# Altium project CRZ Command and Control.PrjPcb
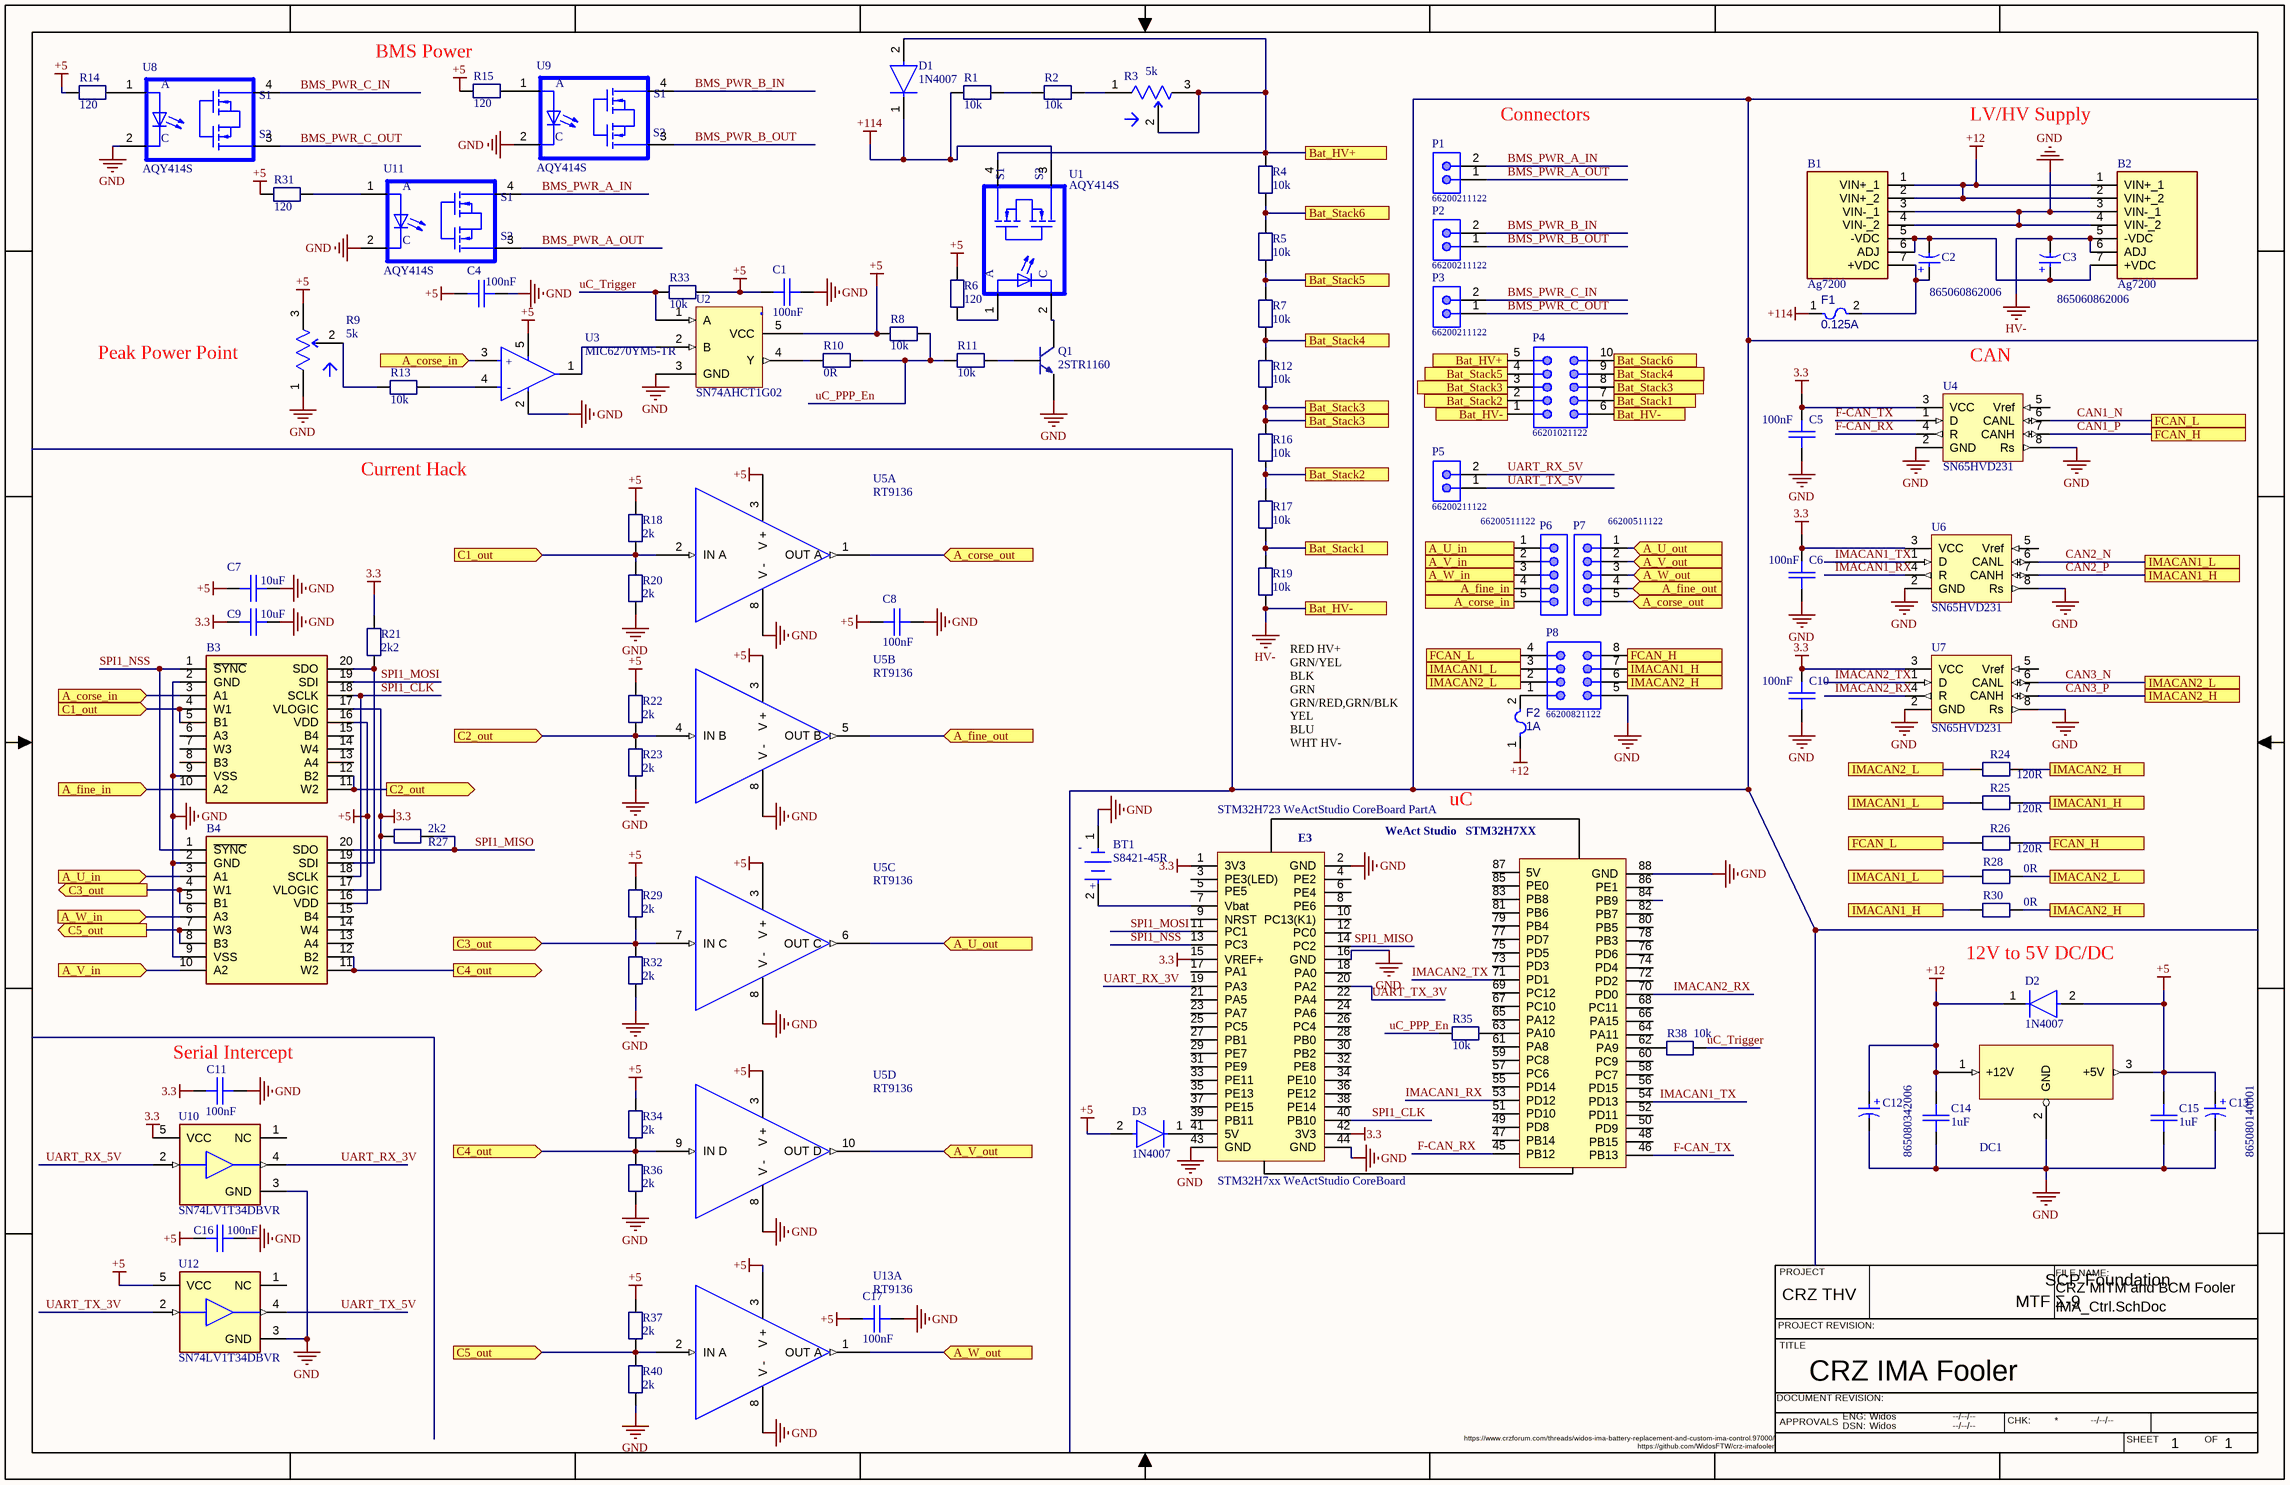
[diagram p0: IMA_Ctrl.SchDoc]
CAGE_CODE: ?????; CONTRACT_NUMBER: <CONTRACT NO>; DOC_NO_ASSY_DWG: <ASSY DWG NO>; DOC_NO_BOM: <BOM DOC NO>; DOC_NO_FAB_DWG: <FAB DWG NO>; DOC_NO_SCH_DWG: <SCH DWG NO>; PCB_2_DEC_TOL: +/-.01; PCB_3_DEC_TOL: +/-.010; PCB_ANG_TOL: +/-1/2; PCB_ASSEMBLY_NO: <PCB ASSY NO>; PCB_CHECKER: - -----; PCB_CHECKER_APP_DATE: --/--/----; PCB_DESIGNER: - -----; PCB_DESIGNER_APP_DATE: --/--/----; PCB_DWG_NO: <PCB DWG NO>; PCB_ENGINEER: - -----; PCB_ENGINEER_APP_DATE: --/--/----; PCB_PART_NUMBER: <PCB PN>; PCB_REV: A; SCH_REV: A
1 sheet, 90 parts. Net scope: flat (ports and power ports of the same name join across sheets).
Board file: CRZ_IMAFool.PcbDoc

## Sheet IMA_Ctrl.SchDoc: CRZ IMA Fooler
size 431 x 279 mm; Date: 01.11.2023; Author: Widos; CompanyName: CR-Z Forum; DrawnBy: Widos; Engineer: Widos; Address1: https://www.crzforum.com/threads/widos-ima-battery-replacement-and-custom-ima-control.97000/; Address2: https://github.com/WidosFTW/crz-imafooler; DocumentNumber: 1; Revision: 3; SheetNumber: 1; SheetTotal: 1; Project: CRZ THV; ENG_APP_DATE: --/--/--; DSN_APP_DATE: --/--/--; CHK_APP_DATE: --/--/--; DocumentDescription: CRZ MITM and BCM Fooler; Time: 22:00; ImagePath: C:\Users\widos\Downloads\crz.png

### Parts
B1  Ag7200  [Ag7200]
B2  Ag7200  [Ag7200]
B3  AD5144BRUZ10  [SOP65P640X120-20N]  (value not drawn)
B4  AD5144BRUZ10  [SOP65P640X120-20N]  (value not drawn)
BT1  S8421-45R  [FP-S8421-45R-MFG]
C1  Capacity: 100nF  [0805_Cap]  (hidden comment: 0805_Cap)
C2  865060862006  [WCAP-ASLL_D12.5H14]
C3  865060862006  [WCAP-ASLL_D12.5H14]
C4  Capacity: 100nF  [0805_Cap]  (hidden comment: 0805_Cap)
C5  Capacity: 100nF  [0805_Cap]  (hidden comment: 0805_Cap)
C6  Capacity: 100nF  [0805_Cap]  (hidden comment: 0805_Cap)
C7  Capacity: 10uF  [0805_Cap]  (hidden comment: 0805_Cap)
C8  Capacity: 100nF  [0805_Cap]  (hidden comment: 0805_Cap)
C9  Capacity: 10uF  [0805_Cap]  (hidden comment: 0805_Cap)
C10  Capacity: 100nF  [0805_Cap]  (hidden comment: 0805_Cap)
C11  Capacity: 100nF  [0805_Cap]  (hidden comment: 0805_Cap)
C12  865080342006  [WCAP-ASLI_D5H5.5]
C13  865080140001  [WCAP-ASLI_D4H5.5]
C14  Capacity: 1uF  [0805_Cap]  (hidden comment: 0805_Cap)
C15  Capacity: 1uF  [0805_Cap]  (hidden comment: 0805_Cap)
C16  Capacity: 100nF  [0805_Cap]  (hidden comment: 0805_Cap)
C17  Capacity: 100nF  [0805_Cap]  (hidden comment: 0805_Cap)
D1  1N4007  [FP-1N4007-MFG]
D2  1N4007  [FP-1N4007-MFG]
D3  1N4007  [FP-1N4007-MFG]
DC1  RECOM-785-5.0  [RECOM_DCDC]  (value not drawn)
F1  0.125A  [LFUS-466_V]
F2  1A  [LFUS-466_V]
P1  66200211122  [66200211122]
P2  66200211122  [66200211122]
P3  66200211122  [66200211122]
P4  66201021122  [66201021122]
P5  66200211122  [66200211122]
P6  66200511122  [66200511122]
P7  66200511122  [66200511122]
P8  66200821122  [66200821122]
Q1  2STR1160  [SOT85P255X140-3N]
R1  Resistance: 10k  [0805_Res]  (hidden comment: 0805_Resistor)
R2  Resistance: 10k  [0805_Res]  (hidden comment: 0805_Resistor)
R3  5k  [FP-PV36W-MFG]
R4  Resistance: 10k  [0805_Res]  (hidden comment: 0805_Resistor)
R5  Resistance: 10k  [0805_Res]  (hidden comment: 0805_Resistor)
R6  Resistance: 120  [0805_Res]  (hidden comment: 0805_Resistor)
R7  Resistance: 10k  [0805_Res]  (hidden comment: 0805_Resistor)
R8  Resistance: 10k  [0805_Res]  (hidden comment: 0805_Resistor)
R9  5k  [FP-PV36W-MFG]
R10  Resistance: 0R  [0805_Res]  (hidden comment: 0805_Resistor)
R11  Resistance: 10k  [0805_Res]  (hidden comment: 0805_Resistor)
R12  Resistance: 10k  [0805_Res]  (hidden comment: 0805_Resistor)
R13  Resistance: 10k  [0805_Res]  (hidden comment: 0805_Resistor)
R14  Resistance: 120  [0805_Res]  (hidden comment: 0805_Resistor)
R15  Resistance: 120  [0805_Res]  (hidden comment: 0805_Resistor)
R16  Resistance: 10k  [0805_Res]  (hidden comment: 0805_Resistor)
R17  Resistance: 10k  [0805_Res]  (hidden comment: 0805_Resistor)
R18  Resistance: 2k  [0805_Res]  (hidden comment: 0805_Resistor)
R19  Resistance: 10k  [0805_Res]  (hidden comment: 0805_Resistor)
R20  Resistance: 2k  [0805_Res]  (hidden comment: 0805_Resistor)
R21  Resistance: 2k2  [0805_Res]  (hidden comment: 0805_Resistor)
R22  Resistance: 2k  [0805_Res]  (hidden comment: 0805_Resistor)
R23  Resistance: 2k  [0805_Res]  (hidden comment: 0805_Resistor)
R24  Resistance: 120R  [0805_Res]  (hidden comment: 0805_Resistor)
R25  Resistance: 120R  [0805_Res]  (hidden comment: 0805_Resistor)
R26  Resistance: 120R  [0805_Res]  (hidden comment: 0805_Resistor)
R27  Resistance: 2k2  [0805_Res]  (hidden comment: 0805_Resistor)
R28  Resistance: 0R  [0805_Res]  (hidden comment: 0805_Resistor)
R29  Resistance: 2k  [0805_Res]  (hidden comment: 0805_Resistor)
R30  Resistance: 0R  [0805_Res]  (hidden comment: 0805_Resistor)
R31  Resistance: 120  [0805_Res]  (hidden comment: 0805_Resistor)
R32  Resistance: 2k  [0805_Res]  (hidden comment: 0805_Resistor)
R33  Resistance: 10k  [0805_Res]  (hidden comment: 0805_Resistor)
R34  Resistance: 2k  [0805_Res]  (hidden comment: 0805_Resistor)
R35  Resistance: 10k  [0805_Res]  (hidden comment: 0805_Resistor)
R36  Resistance: 2k  [0805_Res]  (hidden comment: 0805_Resistor)
R37  Resistance: 2k  [0805_Res]  (hidden comment: 0805_Resistor)
R38  Resistance: 10k  [0805_Res]  (hidden comment: 0805_Resistor)
R40  Resistance: 2k  [0805_Res]  (hidden comment: 0805_Resistor)
STM32H723_WeActStudio_CoreBoard_Part  STM32H7xx WeActStudio CoreBoard  [STM32H7xx Core Board]  (part A of 2)
U1  AQY414S  [SOIC254P695X242-4N]
U2  SN74AHCT1G02  [SOT23-5_LT1716]
U3  MIC6270YM5-TR  [FP-SOT23-5LD-PL-1-MFG]
U4  SN65HVD231  [D008_N]
U5  RT9136  [AD8244]  (parts A,B,C,D of 4)
U6  SN65HVD231  [D008_N]
U7  SN65HVD231  [D008_N]
U8  AQY414S  [SOIC254P695X242-4N]
U9  AQY414S  [SOIC254P695X242-4N]
U10  SN74LV1T34DBVR  [FP-DBV0005A-IPC_B]
U11  AQY414S  [SOIC254P695X242-4N]
U12  SN74LV1T34DBVR  [FP-DBV0005A-IPC_B]
U13  RT9136  [AD8244]  (part A of 4)

### Ports
A_corse_in (in), A_corse_in (out), A_corse_out (in), A_fine_in (in), A_fine_in (out), A_fine_out (in), A_U_in (in), A_U_in (out), A_U_out (in), A_V_in (in), A_V_in (out), A_V_out (in), A_W_in (in), A_W_in (out), A_W_out (in), Bat_HV+, Bat_HV-, Bat_Stack1, Bat_Stack2, Bat_Stack3, Bat_Stack4, Bat_Stack5, Bat_Stack6, C1_out (in), C2_out (in), C2_out (out), C3_out (in), C3_out (out), C4_out (in), C4_out (out), C5_out (in), C5_out (out), FCAN_H, FCAN_L, IMACAN1_H, IMACAN1_L, IMACAN2_H, IMACAN2_L

### Nets
3.3: B3.17(VLOGIC) B4.17(VLOGIC) C5.2 C6.2 C9.1 C10.2 C11.1 R21.1 R27.2 STM32H723_WeActStudio_CoreBoard_Part.1(3V3) STM32H723_WeActStudio_CoreBoard_Part.15(VREF+) STM32H723_WeActStudio_CoreBoard_Part.42(3V3) U4.3(VCC) U6.3(VCC) U7.3(VCC) U10.5(VCC)
+5: B3.16(VDD) B4.16(VDD) C1.1 C4.1 C7.1 C8.1 C13.1(P) C15.2 C16.1 C17.1 D2.2(A) D3.2(A) DC1.3(+5V) R6.2 R8.1 R9.3 R14.1 R15.1 R18.1 R22.1 R29.1 R31.1 R33.2 R34.1 R37.1 U2.5(VCC) U3.5(V+) U5.3(V_+) U12.5(VCC) U13.3(V_+)
+12: B1.1(VIN+_1) B1.2(VIN+_2) B2.1(VIN+_1) B2.2(VIN+_2) C12.1(P) C14.2 D2.1(C) DC1.1(+12V) F2.1
+114: D1.1(C) F1.1 R1.1 U1.3(S2)
GND: B1.3(VIN-_1) B1.4(VIN-_2) B2.3(VIN-_1) B2.4(VIN-_2) B3.2(GND) B3.9(VSS) B4.2(GND) B4.9(VSS) BT1.1(C) C1.2 C4.2 C5.1 C6.1 C7.2 C8.2 C9.2 C10.1 C11.2 C12.2(N) C13.2(N) C14.1 C15.1 C16.2 C17.2 DC1.2(GND) P8.5 Q1.2(E) R9.1 R20.2 R23.2 R32.2 R36.2 R40.2 STM32H723_WeActStudio_CoreBoard_Part.2(GND) STM32H723_WeActStudio_CoreBoard_Part.16(GND) STM32H723_WeActStudio_CoreBoard_Part.43(GND) STM32H723_WeActStudio_CoreBoard_Part.44(GND) STM32H723_WeActStudio_CoreBoard_Part.88(GND) U2.3(GND) U3.2(V-) U4.2(GND) U4.8(Rs) U5.8(V_-) U6.2(GND) U6.8(Rs) U7.2(GND) U7.8(Rs) U8.2(C) U9.2(C) U10.3(GND) U11.2(C) U12.3(GND) U13.8(V_-)
HV-: B2.5(-VDC) B2.6(ADJ) C3.2(N) P4.1 P4.6 R19.2 ; port Bat_HV-
A_corse_in: B3.3(A1) P6.5 U3.3(IN+) ; port A_corse_in
A_corse_out: P7.5 U5.1(OUT_A) ; port A_corse_out
A_fine_in: B3.10(A2) P6.4 ; port A_fine_in
A_fine_out: P7.4 U5.5(OUT_B) ; port A_fine_out
A_U_in: B4.3(A1) P6.1 ; port A_U_in
A_U_out: P7.1 U5.6(OUT_C) ; port A_U_out
A_V_in: B4.10(A2) P6.2 ; port A_V_in
A_V_out: P7.2 U5.10(OUT_D) ; port A_V_out
A_W_in: B4.6(A3) P6.3 ; port A_W_in
A_W_out: P7.3 U13.1(OUT_A) ; port A_W_out
Bat_HV+: D1.2(A) P4.5 R3.2(Wiper) R3.3 R4.1 U1.4(S1) ; port Bat_HV+
Bat_Stack1: P4.7 R17.2 R19.1 ; port Bat_Stack1
Bat_Stack2: P4.2 R16.2 R17.1 ; port Bat_Stack2
Bat_Stack3: P4.3 P4.8 R12.2 R16.1 ; port Bat_Stack3
Bat_Stack4: P4.9 R7.2 R12.1 ; port Bat_Stack4
Bat_Stack5: P4.4 R5.2 R7.1 ; port Bat_Stack5
Bat_Stack6: P4.10 R4.2 R5.1 ; port Bat_Stack6
BMS_PWR_A_IN: P1.2 U11.4(S1)
BMS_PWR_A_OUT: P1.1 U11.3(S2)
BMS_PWR_B_IN: P2.2 U9.4(S1)
BMS_PWR_B_OUT: P2.1 U9.3(S2)
BMS_PWR_C_IN: P3.2 U8.4(S1)
BMS_PWR_C_OUT: P3.1 U8.3(S2)
C1_out: B3.4(W1) B3.5(B1) R18.2 R20.1 U5.2(IN_A) ; port C1_out
C2_out: B3.11(W2) B3.12(B2) R22.2 R23.1 U5.4(IN_B) ; port C2_out
C3_out: B4.4(W1) B4.5(B1) R29.2 R32.1 U5.7(IN_C) ; port C3_out
C4_out: B4.11(W2) B4.12(B2) R34.2 R36.1 U5.9(IN_D) ; port C4_out
C5_out: B4.7(W3) B4.8(B3) R37.2 R40.1 U13.2(IN_A) ; port C5_out
CAN1_N: P8.4 R26.1 U4.6(CANL) ; port FCAN_L
CAN1_P: P8.8 R26.2 U4.7(CANH) ; port FCAN_H
CAN2_N: P8.3 R25.1 R28.1 U6.6(CANL) ; port IMACAN1_L
CAN2_P: P8.7 R25.2 R30.1 U6.7(CANH) ; port IMACAN1_H
CAN3_N: P8.2 R24.1 R28.2 U7.6(CANL) ; port IMACAN2_L
CAN3_P: P8.6 R24.2 R30.2 U7.7(CANH) ; port IMACAN2_H
F-CAN_RX: STM32H723_WeActStudio_CoreBoard_Part.45(PB12) U4.4(R)
F-CAN_TX: STM32H723_WeActStudio_CoreBoard_Part.46(PB13) U4.1(D)
IMACAN1_RX: STM32H723_WeActStudio_CoreBoard_Part.53(PD12) U6.4(R)
IMACAN1_TX: STM32H723_WeActStudio_CoreBoard_Part.54(PD13) U6.1(D)
IMACAN2_RX: STM32H723_WeActStudio_CoreBoard_Part.70(PD0) U7.4(R)
IMACAN2_TX: STM32H723_WeActStudio_CoreBoard_Part.71(PD1) U7.1(D)
SPI1_CLK: B3.18(SCLK) B4.18(SCLK) STM32H723_WeActStudio_CoreBoard_Part.40(PB10)
SPI1_MISO: B4.20(SDO) R27.1 STM32H723_WeActStudio_CoreBoard_Part.14(PC2)
SPI1_MOSI: B3.19(SDI) STM32H723_WeActStudio_CoreBoard_Part.11(PC1)
SPI1_NSS: B3.1(~{SYNC}) B4.1(~{SYNC}) STM32H723_WeActStudio_CoreBoard_Part.13(PC3)
UART_RX_3V: STM32H723_WeActStudio_CoreBoard_Part.19(PA3) U10.4(Y)
UART_RX_5V: P5.2 U10.2(A)
UART_TX_3V: STM32H723_WeActStudio_CoreBoard_Part.20(PA2) U12.2(A)
UART_TX_5V: P5.1 U12.4(Y)
uC_PPP_En: R8.2 R10.2 R11.1 R35.2
uC_Trigger: R33.1 R38.2 U2.1(A)
NetB1_5: B1.5(-VDC) B1.6(ADJ) B2.7(+VDC) C2.2(N) C3.1(P)
NetB1_7: B1.7(+VDC) C2.1(P) F1.2
NetB3_20: B3.20(SDO) B4.19(SDI) R21.2
NetBT1_2: BT1.2(A) STM32H723_WeActStudio_CoreBoard_Part.7(Vbat)
NetD3_1: D3.1(C) STM32H723_WeActStudio_CoreBoard_Part.41(5V)
NetF2_2: F2.2 P8.1
NetQ1_1: Q1.1(B) R11.2
NetQ1_3: Q1.3(C) U1.2(C)
NetR1_2: R1.2 R2.1
NetR2_2: R2.2 R3.1
NetR6_1: R6.1 U1.1(A)
NetR9_2: R9.2(Wiper) R13.1
NetR10_1: R10.1 U2.4(Y)
NetR13_2: R13.2 U3.4(IN-)
NetR14_2: R14.2 U8.1(A)
NetR15_2: R15.2 U9.1(A)
NetR31_2: R31.2 U11.1(A)
NetR35_1: R35.1 STM32H723_WeActStudio_CoreBoard_Part.63(PA10)
NetR38_1: R38.1 STM32H723_WeActStudio_CoreBoard_Part.62(PA9)
NetU2_2: U2.2(B) U3.1(OUT)

Not connected (* = marked no-connect by the designer): B3 6(A3) 7(W3) 8(B3) 13(A4) 14(W4) 15(B4); B4 13(A4) 14(W4) 15(B4); STM32H723_WeActStudio_CoreBoard_Part 3(PE3(LED)) 4(PE2) 5(PE5) 6(PE4) 8(PE6) 9(NRST) 10(PC13(K1)) 12(PC0) 17(PA1) 18(PA0) 21(PA5) 22(PA4) 23(PA7) 24(PA6) 25(PC5) 26(PC4) 27(PB1) 28(PB0) 29(PE7) 30(PB2) 31(PE9) 32(PE8) 33(PE11) 34(PE10) 35(PE13) 36(PE12) 37(PE15) 38(PE14) 39(PB11) 47(PB14) 48(PB15) 49(PD8) 50(PD9) 51(PD10) 52(PD11) 55(PD14) 56(PD15) 57(PC6) 58(PC7) 59(PC8) 60(PC9) 61(PA8) 64(PA11) 65(PA12) 66(PA15) 67(PC10) 68(PC11) 69(PC12) 72(PD2) 73(PD3) 74(PD4) 75(PD5) 76(PD6) 77(PD7) 78(PB3) 79(PB4) 80(PB5) 81(PB6) 82(PB7) 83(PB8) 84(PB9) 85(PE0) 86(PE1) 87(5V); U4 5(Vref); U6 5(Vref); U7 5(Vref); U10 1(NC); U12 1(NC)

### Notes on the sheet
- (near R15) BMS Power
- Connectors
- LV/HV Supply
- (near R9) Peak Power Point
- (near U4) CAN
- Current Hack
- (near R19) RED HV+
  GRN/YEL
  BLK
  GRN
  GRN/RED,GRN/BLK
  YEL
  BLU
  WHT HV-
- uC
- 12V to 5V DC/DC
- (near C11) Serial Intercept
- PROJECT
- MTF Σ-9
- SCP Foundation
- FILE NAME:
- PROJECT REVISION:
- TITLE
- DOCUMENT REVISION:
- APPROVALS
- ENG:
- DSN:
- CHK:
- SHEET
- OF
- (in symbol CMP-038-000000-1, part A) WeAct Studio; STM32H7XX; E3
- (in symbol CMP-2000-07028-3) -; +
- (in symbol CMP-03913-53914532-1) +
- (in symbol CMP-03913-53914570-1) +
- (in symbol CMP-03913-130590180-1) +
- (in symbol CMP-06303-000001-1) +; -

### Library data of the parts
B1 B2 = CMP-029-000000-1: Isolated DC/DC Converters 20W boost converter. 36V-57Vout, 5V-15V in, SIL; Manufacturer_Name: Silvertel; Geometry.Height: 14mm; Design Item ID: Ag7200; Mouser Part Number: 480-AG7200; Datasheet Link: https://silvertel.com/images/datasheets/Ag7200-datasheet-20W-Isolated-57V-DC-DC-Boost-Converter-Module.pdf; Mouser Price/Stock: https://www.mouser.co.uk/ProductDetail/Silvertel/Ag7200?qs=OlC7AqGiEDkYk2DJmVBe2Q%3D%3D; Source: Ag7200.SchLib; Arrow Price/Stock: *; Manufacturer_Part_Number: Ag7200; Arrow Part Number: *
B3 B4 = CMP-036-000000-1: AD5144BRUZ10, Digital Potentiometer 10k 256-Position Linear 4-channel Serial-SPI 20-Pin TSSOP; Manufacturer_Name: Analog Devices; Geometry.Height: 1.2mm; Arrow Part Number: AD5144BRUZ10; Mouser Part Number: 584-AD5144BRUZ10; Manufacturer_Part_Number: AD5144BRUZ10; Mouser Price/Stock: https://www.mouser.co.uk/ProductDetail/Analog-Devices/AD5144BRUZ10?qs=NmRFExCfTkGSml8dn6R%2FyA%3D%3D; Source: AD5144BRUZ10.SchLib; Arrow Price/Stock: https://www.arrow.com/en/products/ad5144bruz10/analog-devices?region=nac; Design Item ID: AD5144BRUZ10; Datasheet Link: http://uk.rs-online.com/web/p/products/7968827
BT1 = CMP-2000-07028-3: BATTERY HOLDER COIN 20MM SMD; Number of Cells: 1; Min Operating Temperature: -40°C; Packaging: Tape and Reel; Max Operating Temperature: 105°C; Number of Batteries: 1; Package Quantity: 500; Material: Polyphenylene; Case/Package: SMD/SMT; Mount: Surface Mount; REACH SVHC: No SVHC; Contact Plating: Bronze; Termination: SMD/SMT
C1 C4-C11 C14-C17 = CMP-004-000000-1: Component Type: Standard; Design Item ID: 0805_Cap; Source: KEMET.SchLib; Pin Count: 2
C2 C3 = CMP-03913-130590180-1: 865060862006 Cap, 68Uf, 20%, 100V, Alu Elec Smd Rohs Compliant: Yes; Ripple Current: 600mA; Leakage Current: 68µA; Impedance: 700mΩ; Insulation Resistance: 1.47059MΩ; Capacitance: 68µF; Width: 13.5mm; Diameter: 12.5mm; NexarPartId: 130590180; Length: 14mm; Voltage Rating: 100V
C12 = CMP-03913-53914570-1: 865080342006 WCAP-ASLI Aluminum Electrolytic Capacitors; ESR (Equivalent Series Resistance): 832.685mΩ; Impedance: 1.05Ω; Voltage Rating: 16V; Leakage Current: 7.52µA; Ripple Current: 195mA; Polarity: Polar; Insulation Resistance: 2.12766MΩ; Capacitance: 47µF; Tolerance: 20%; Life (Hours): 2000hours; Min Operating Temperature: -55°C; Case/Package: Radial; Height: 5.5mm; Height - Seated (Max): 5.5118mm; Diameter: 5mm; Width: 5.3mm; Voltage Rating (DC): 16V; Max Operating Temperature: 105°C; Ripple Current (AC): 195mA; Mount: Surface Mount; RoHS: Compliant; Packaging: Tape & Reel (TR); REACH SVHC: Unknown; NexarPartId: 53914570; Length: 5.5mm
C13 = CMP-03913-53914532-1: 865080140001 WCAP-ASLI Aluminum Electrolytic Capacitors; Life (Hours): 2000hours; ESR (Equivalent Series Resistance): 1.72087Ω; Capacitance: 22µF; Leakage Current: 3µA; Polarity: Polar; Tolerance: 20%; Voltage Rating: 6.3V; Insulation Resistance: 2.1MΩ; Ripple Current (AC): 75mA; Impedance: 2.2Ω; NexarPartId: 53914532; Packaging: Tape & Reel (TR); Min Operating Temperature: -55°C; Case/Package: Radial; Length: 5.5mm; Diameter: 4mm; RoHS: Compliant; Mount: Surface Mount; Height - Seated (Max): 5.5118mm; Voltage Rating (DC): 6.3V; Height: 5.5mm; Max Operating Temperature: 105°C; Width: 4.3mm; REACH SVHC: Unknown; Ripple Current: 75mA
D1-D3 = CMP-123542-000001-1: Rectifier diode 1000 V 1 A DO-41, ,; Manufacturer: Diotec; Max Surge Forward Current: 27A; Forward Current: 1A; Max Junction Temp: +175°C; Reverse Voltage: 1000V; Value: 15pF; Peak Reverse Current: 5uA; Category: Diode; Temperature Range Low: -50°C; Automotive: No; Temperature: -50°C to +175°C; Lead Free: Yes; ComponentLink2Description: Datasheet; Max Repetitive Reverse Voltage: 1000V; ComponentLink2URL: https://datasheet.octopart.com/1N4007-Diotec-datasheet-62346875.pdf; Manufacturer Part Number: 1N4007; Device Class L3: Rectifier Diodes; Height: 2.8mm; Octopart: https://octopart.com/1n4007-diotec-4040411; Package: 1N4007; Temperature Range High: +175°C; Device Class L1: Discrete Semiconductors; Device Class L2: Diodes; RoHS: TRUE; Capacitance: 15pF; Ipc Land Pattern Name: DIOAD888W100L520D280
DC1 = CMP-007-000012-1: RECOM 785-5.0 DC/DC; Pin Count: 3; Design Item ID: RECOM-785-5.0; Source: RECOM_785-5.0.SchLib; Component Type: Standard
F1 F2 = CMP-005-00010-2: Surface Mount Fuses 7A 24V VFA SLIMLINE; Current Rating: 7A; Pins: 2
P1-P3 P5 = CMP-020-000001-1: THT Male Header WR-MPC3, Vertical, Single Row, pitch 3 mm, 2 pins; Contact Resistance: 10 mOhm; Pitch: 3 mm; Working Voltage: 250 VAC; Pin Number: 2; ComponentLink1URL: http://www.we-online.de; Part Number: 66200211122; Design Item ID: 66200211122; Pin Count: 2; Publisher: Wurth Elektronik; Operating Temperature: -40 to 105 degC; Source: Male Headers WR-MPC3.SchLib; ComponentLink2URL: https://katalog.we-online.de/em/datasheet/6620xx11122.pdf; Gender: Male; Published Date: September 2018; Orientation: Vertical; Mounting Technology: THT; ComponentLink1Description: Manufacturer; ComponentLink2Description: Datasheet; Packaging: Tube; Component Type: Standard
P4 = CMP-020-000047-1: THT Male Header WR-MPC3, Vertical, Dual Row, pitch 3 mm, 10 pins; Working Voltage: 250 VAC; Pitch: 3 mm; Contact Resistance: 10 mOhm; Pin Number: 10; Publisher: Wurth Elektronik; Operating Temperature: -40 to 105 degC; Mounting Technology: THT; ComponentLink1Description: Manufacturer; Packaging: Tube; ComponentLink2Description: Datasheet; Component Type: Standard; Design Item ID: 66201021122; ComponentLink2URL: https://katalog.we-online.de/em/datasheet/6620xx21122.pdf; Part Number: 66201021122; Gender: Male; Orientation: Vertical; Pin Count: 10; Published Date: September 2018; Source: Male Headers WR-MPC3.SchLib; ComponentLink1URL: http://www.we-online.de
P6 P7 = CMP-020-000021-1: THT Male Header WR-MPC3, Vertical, Single Row, pitch 3 mm, 5 pins; Contact Resistance: 10 mOhm; Working Voltage: 250 VAC; Pitch: 3 mm; Pin Number: 5; Pin Count: 5; Component Type: Standard; ComponentLink1URL: http://www.we-online.de; Design Item ID: 66200511122; Orientation: Vertical; Mounting Technology: THT; ComponentLink1Description: Manufacturer; Publisher: Wurth Elektronik; ComponentLink2Description: Datasheet; Gender: Male; ComponentLink2URL: https://katalog.we-online.de/em/datasheet/6620xx11122.pdf; Packaging: Tube; Source: Male Headers WR-MPC3.SchLib; Published Date: September 2018; Part Number: 66200511122; Operating Temperature: -40 to 105 degC
P8 = CMP-020-000036-1: THT Male Header WR-MPC3, Vertical, Dual Row, pitch 3 mm, 8 pins; Working Voltage: 250 VAC; Pin Number: 8; Pitch: 3 mm; Contact Resistance: 10 mOhm; Source: Male Headers WR-MPC3.SchLib; ComponentLink2URL: https://katalog.we-online.de/em/datasheet/6620xx21122.pdf; Orientation: Vertical; Pin Count: 8; Component Type: Standard; Design Item ID: 66200821122; ComponentLink2Description: Datasheet; Publisher: Wurth Elektronik; Part Number: 66200821122; Gender: Male; ComponentLink1Description: Manufacturer; Published Date: September 2018; Mounting Technology: THT; Packaging: Tube; Operating Temperature: -40 to 105 degC; ComponentLink1URL: http://www.we-online.de
Q1 = CMP-018-000000-1: Low voltage fast-switching NPN power transistor; Component Type: Standard; Pin Count: 3; Source: 2STRx160.SchLib; Design Item ID: 2STR1160
R1 R2 R4-R8 R10-R38 R40 = CMP-015-000000-1: Component Type: Standard; Pin Count: 2; Design Item ID: 0805_Resistor; Source: Resistors.SchLib
R3 R9 = CMP-07234-000009-1: TRIMMER 1K OHM 0.5W PC PIN TOP; Manufacturer Part Number: PV36W102C01B00; Manufacturer: Bourns; Temperature Coefficient: 100ppm/°C; Standoff Height: 0.38mm; Resistance: 1kΩ; Tolerance: 10%; Value: 1kΩ; Octopart: https://octopart.com/pv36w102c01b00-bourns-71612321; ComponentLink2URL: https://www.bourns.com/docs/Product-Datasheets/pv36.pdf; Category: Res; RoHS: TRUE; Device Class L1: Passive Components; Height: 12.05mm; ComponentLink2Description: Datasheet; Mouser Description: Trimmer Resistors - Through Hole 1.0Kohms 10mm Square 25turn; Package: PV36W; Device Class L2: Resistors; Power Rating: 0.5W; Digikey Description: TRIMMER 1K OHM 0.5W PC PIN TOP; Automotive: No; Temperature Range High: +125°C; Series: PV36; Temperature Range Low: -55°C; Temperature: -55°C to +125°C; Device Class L3: Variable Resistors and Potentiometers; Composition: Cermet; Lead Free: Yes
STM32H723_WeActStudio_CoreBoard_Part = CMP-038-000000-1: Component Type: Standard; Design Item ID: STM32H7xx WeActStudio CoreBoard; Pin Count: 92; Source: STM32H750VB CoreBoard WeActStudio.SchLib
U1 U8 U9 U11 = CMP-031-000000-1: Solid State SPST-NO _1 Form A_ 4-SOP _0.173, 4.40mm_; MF: Vishay; Digi-Key_Purchase_URL: https://www.digikey.com/product-detail/en/vishay-semiconductor-opto-division/VO1400AEFTR/VO1400AEFCT-ND/4743822?utm_source=snapeda&utm_medium=aggregator&utm_campaign=symbol; Component Type: Standard; Pin Count: 4; Design Item ID: VO1400AEFTR; Value: *; MP: VO1400AEFTR; Package: SOP-4 Vishay; Source: SnapEDAsch.SchLib; Digi-Key_Part_Number: VO1400AEFCT-ND; SnapEDA_Link: https://www.snapeda.com/parts/VO1400AEFTR/Vishay%20Semiconductor%20Opto%20Division/view-part/427521/?ref=snap
U2 = CMP-018-000101-4: Single 2-Input Negative Gate; Source: SN74AHCT1G02.SchLib; Design Item ID: SN74AHCT1G02; Component Type: Standard; Pin Count: 5
U3 = CMP-06303-000001-1: IC COMPARATOR PREC 2-36V SOT23-5; Manufacturer: Microchip; Input Offset Voltage: 2mV; Max Supply Voltage: 36V; Voltage Gain: 200V/mV; Output Current Per Channel: 20mA; Number Of Channels: 1; Standoff Height: 0mm; Response Time: 0.6us; Min Supply Voltage: 2V; Input Bias Current: 0.025uA; Nominal Supply Current: 0.3-0.4mA; Temperature: -40°C to +85°C; Digikey Description: IC COMPARATOR PREC 2-36V SOT23-5; ComponentLink2URL: http://ww1.microchip.com/downloads/en/DeviceDoc/MIC6270-IttyBitty-Comparator-DS20006294A.pdf; Ambient Temperature Range High: +125°C; ComponentLink2Description: Datasheet; Category: IC; Ambient Temperature Range Low: -40°C; Manufacturer Part Number: MIC6270YM5-TR; Package: SOT23-5LD-PL-1; RoHS: TRUE; Temperature Range High: +85°C; Temperature Range Low: -40°C; Height: 1.45mm; Device Class L1: Integrated Circuits (ICs); Lead Free: Yes; Octopart: https://octopart.com/mic6270ym5-tr-microchip-66803510; Automotive: No; Device Class L2: Linear ICs; Device Class L3: Comparators; Mouser Description: Analog Comparators
U4 U6 U7 = CMP-018-000094-1: 3.3-V CAN Transceiver; Pin Count: 8; Source: SN65HVD231.SchLib; Design Item ID: SN65HVD231; Component Type: Standard
U5 U13 = CMP-014-00004-1: Quad Buffer, Alternative zum AD8244, MSOP-10, Andere Pinbelegung
U10 U12 = CMP-0859-00123-4: IC BUF NON-INVERT 5.5V SOT23-5; Low Level Output Current: 8mA; Polarity: Non-Inverting; Number of Channels: 1; Propagation Delay: 15.5ns; High Level Output Current: -8mA; Quiescent Current: 1uA; Logic Function: Buffer; Min Supply Voltage: 1.6V; Min Operating Temperature: -40°C; Package Quantity: 3000; Max Operating Temperature: 125°C; Operating Supply Current: 8mA; Radiation Hardening: No; REACH SVHC: No SVHC; Number of Bits per Element: 1; Mount: Surface Mount; Number of Outputs: 1; Lead Free: Lead Free; Number of Pins: 5; Weight: 0.000353oz; Number of Output Lines: 1; Number of Elements: 1; Number of Input Lines: 1; Number of Bits: 1; Case/Package: SOT-23-5; Packaging: Tape and Reel; Max Supply Voltage: 5.5V; Number of Inputs: 1